# EAGLE design Simple-Bug-2N2222 (EAGLE 7.7.0)
Simple FM Transmitter with Electret Microphone, based on NPN Transistor
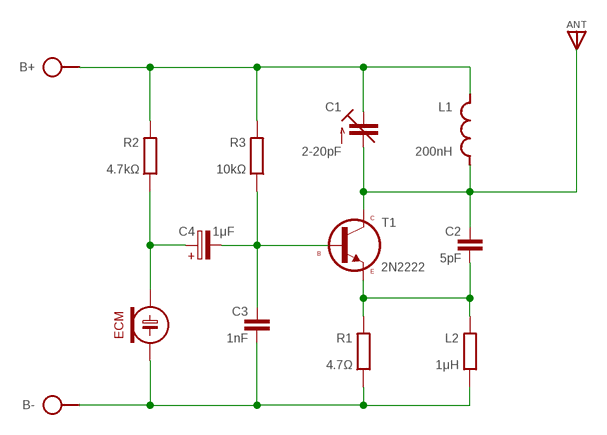
[diagram p0: schematic, sheet 1]

## Parts
ANT  ANT  [SPAD]
B+  HPORT  [SPAD]
B-  HPORT  [SPAD]
C1  2-20pF  C-TR-PH20127  [TRIM-2222-808]
C2  5pF  C050-020X036  [C050-020X036]
C3  1nF  C050-020X036  [C050-020X036]
C4  1μF  CPOL-HE2,5-3  [E2,5-3]
ECM  ECM-5  [ECM-5]
L1  200nH  L-SHORT04/7V-X  [L-04/7V-X]
L2  1μH  R0204/2V-A  [0204/2V]
R1  4.7Ω  R0204/2V-A  [0204/2V]
R2  4.7kΩ  R0204/10-V  [0204/10-V]
R3  10kΩ  R0204/10-V  [0204/10-V]
T1  2N2222  [TO92]

## Nets
+: B+.1 C1.1(E) C1.3(E) L1.2 R2.1 R3.1
-: B-.1 C3.2 ECM.2(-) L2.1 R1.1
AF: C4.+ ECM.1(+) R2.2
BIAS: C2.2 L2.2 R1.2 T1.1(E)
MOD: C3.1 C4.- R3.2 T1.2(B)
RF: ANT.1 C1.2(A) C2.1 L1.1 T1.3(C)

## Library data of the parts
ANT = pad:ANT
B+ B- = pad:HPORT
C1 = cap-trim:C-TR-PH20127
C2 C3 = c:C: CAPACITOR, European symbol
C4 = c:CPOL-H
ECM = ECM:ECM
L1 = l:L-SHORT
L2 R1-R3 = r:R: RESISTOR, European symbol
T1 = t:2N2222

## Net classes
0 default: width 0.61 mm

## Board
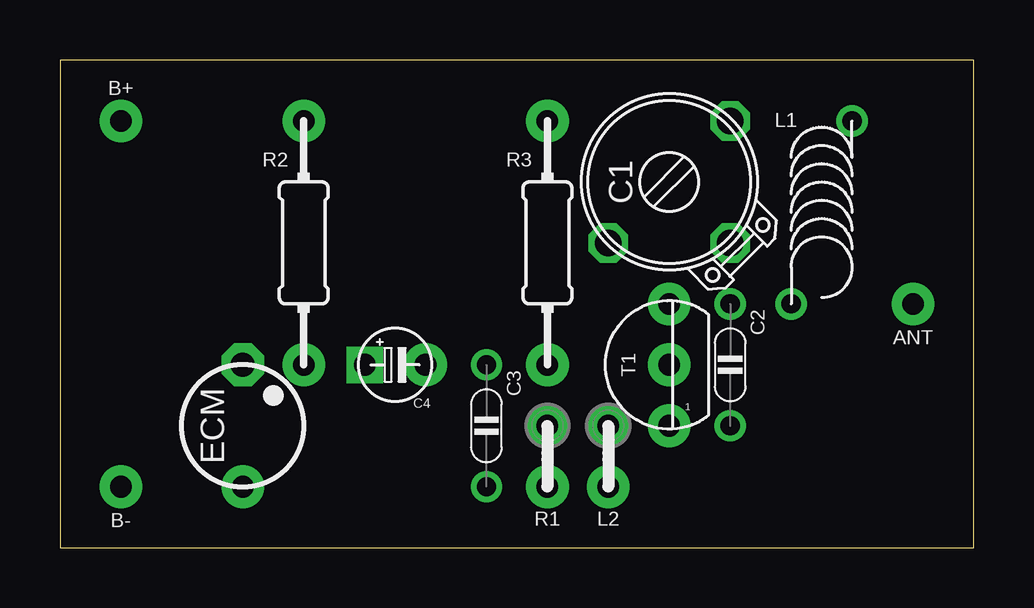
[diagram p1: board, top side]
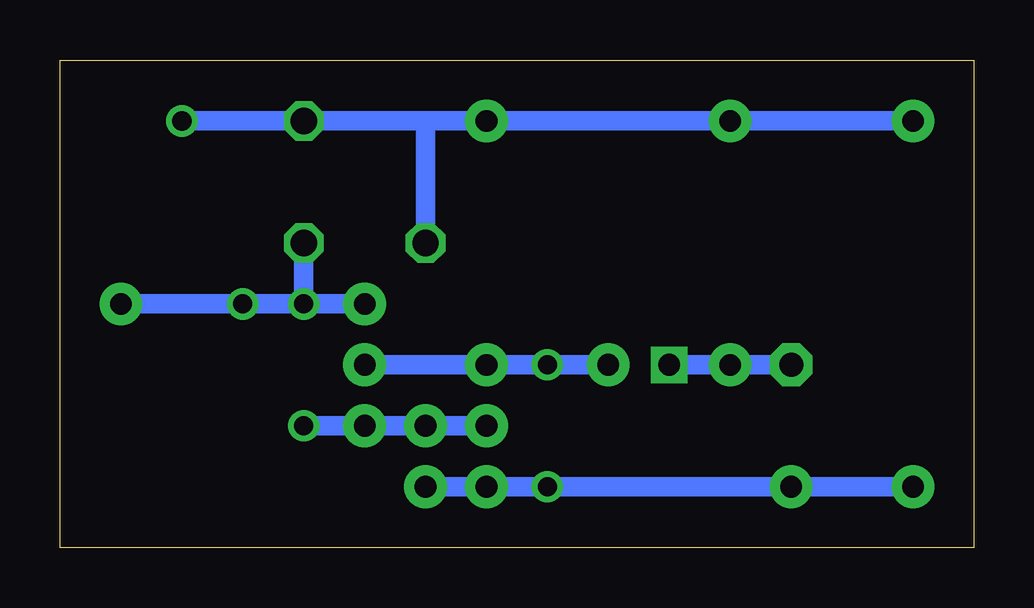
[diagram p2: board, bottom side, seen from below]

Size 38.1 x 20.32 mm. Coordinates in mm from the lower left corner, seen from the top.
Outline: 0,0 38.1,0 38.1,20.32 0,20.32 0,0
Copper layers (1*16): Top 0.035mm / dielectric 1.5mm / Bottom 0.035mm
Design rules "default": minimum track width 10mil, minimum drill 24mil, track to track 8mil, track to pad 8mil, pad to pad 8mil, via to via 8mil, smd to smd 8mil, copper to edge 40mil, drill to drill 8mil, minimum pad ring 10mil, minimum via ring 8mil, stop-mask expansion 4mil, vias tented up to drill 0mil, thermal gap 10mil

### Footprints (pad centres in the part's own frame; a part is rotated, then mirrored left to right if it is on the bottom)
SPAD = drill 0.9 pad 1.778: 1 0,0
TRIM-2222-808 = drill 1.1 octagon: 1 -2.54,2.54; 2 -2.54,-2.54; 3 2.54,-2.54
C050-020X036 = drill 0.8: 1 -2.54,0; 2 2.54,0
E2,5-3 = drill 0.9 pad 1.524 square: + -1.27,0 | drill 0.9 pad 1.778: - 1.27,0
ECM-5 = drill 1 pad 1.778 octagon: 1 0,2.54 | drill 0.9 pad 1.778: 2 0,-2.54
L-04/7V-X = drill 0.8: 1 -1.27,-3.81; 2 1.27,3.81
0204/2V = drill 0.9 pad 1.778: 1 0,1.27; 2 0,-1.27
0204/10-V = drill 0.9 pad 1.778: 1 0,5.08; 2 0,-5.08
TO92 = drill 0.9 pad 1.778: 1 0,2.54; 2 0,0; 3 0,-2.54

### Placement (x,y rotation side)
ANT  35.56,10.16 90 top
B+  2.54,17.78 270 top
B-  2.54,2.54 90 top
C1  25.4,15.24 90 top
C2  27.94,7.62 270 top
C3  17.78,5.08 270 top
C4  13.97,7.62 0 top
ECM  7.62,5.08 0 top
L1  31.75,13.97 0 top
L2  22.86,3.81 180 top
R1  20.32,3.81 180 top
R2  10.16,12.7 0 top
R3  20.32,12.7 0 top
T1  25.4,7.62 180 top

### Tracks (layer width: path | path; a pad name or v marks a point on that pad's centre or on a via)
+
  Bottom 0.813: B+.1 R2.1 R3.1 22.86,17.78 | 22.86,17.78 C1.3 L1.2 | C1.1 22.86,17.78
-
  Bottom 0.813: B-.1 ECM.2 C3.2 R1.1 L2.1
AF
  Bottom 0.813: C4.+ R2.2 ECM.1
BIAS
  Bottom 0.813: C2.2 T1.1 L2.2 R1.2
MOD
  Bottom 0.813: T1.2 R3.2 C3.1 C4.-
RF
  Bottom 0.813: T1.3 C2.1 | C2.1 L1.1 ANT.1 | C1.2 C2.1